# Altium schematic sheet ELEC-DEM-555Timer.SchDoc
size A4
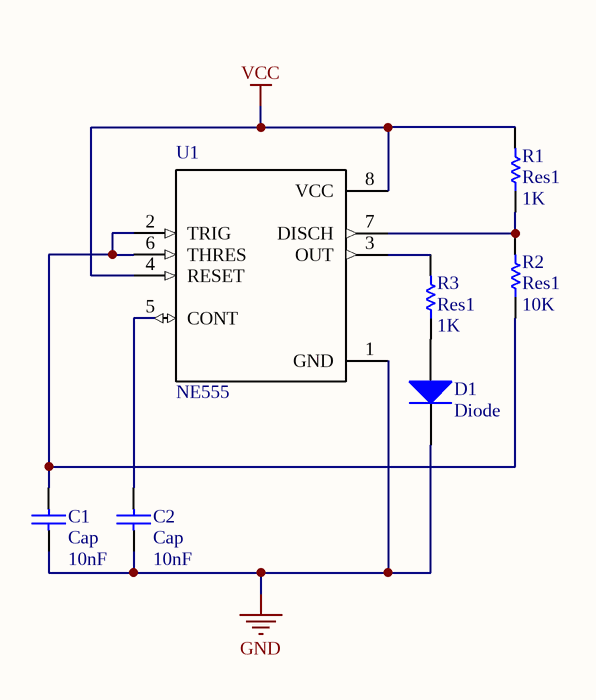
[diagram p0: ELEC-DEM-555Timer.SchDoc]

## Parts
C1  Cap  value 10nF  [RAD-0.3]
C2  Cap  value 10nF  [RAD-0.3]
D1  Diode  [SMC]
R1  Res1  value 1K  [AXIAL-0.3]
R2  Res1  value 10K  [AXIAL-0.3]
R3  Res1  value 1K  [AXIAL-0.3]
U1  NE555  [DIP794W45P254L1060H508Q8]

## Nets
GND: C1.1 C2.1 D1.2(K) U1.1(GND)
VCC: R1.2 U1.4(RESET) U1.8(VCC)
NetC1_2: C1.2 R2.1 U1.2(TRIG) U1.6(THRES)
NetC2_2: C2.2 U1.5(CONT)
NetD1_1: D1.1(A) R3.1
NetR1_1: R1.1 R2.2 U1.7(DISCH)
NetR3_2: R3.2 U1.3(OUT)

## Library data of the parts
C1 C2 = Cap: Capacitor; Published: 8-Jun-2000; LatestRevisionDate: 17-Jul-2002; LatestRevisionNote: Re-released for DXP Platform.; PackageReference: RAD-0.3; Publisher: Altium Limited; PackageDescription: Radial Cap, Thru-Hole; 2 Leads; 0.3 in Pin Spacing
D1 = Diode: Default Diode; Published: 8-Jun-2000; LatestRevisionDate: 17-Jul-2002; LatestRevisionNote: Re-released for DXP Platform.; PackageVersion: Sep-1996; PackageReference: SMC; Publisher: Altium Limited; PackageDescription: DO-214-AB/SMC; 2 C-Bend Leads; Body 7.9 x 5.9 mm, inc. leads (LxW); Code_JEDEC: DO-214-AB
R1-R3 = Res1: Resistor; Published: 8-Jun-2000; LatestRevisionDate: 17-Jul-2002; LatestRevisionNote: Re-released for DXP Platform.; PackageReference: AXIAL-0.3; Publisher: Altium Limited; PackageDescription: Axial Device, Thru-Hole; 2 Leads; 0.3 in Pin Spacing
U1 = NE555: 555 Timing Circuit IC 8-Pin DIP 8-Pin DIP Timer ICThe NE555 monolithic timing circuit is a highly stable controller c...; MF: MCM Electronics; SnapEDA_Link: https://www.snapeda.com/parts/NE555/MCM%20Electronics/view-part/?ref=snap; Availability: Unavailable; Package: DIP-8 MCM Electronics; MP: NE555; Price: None; Value: *